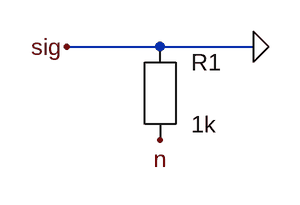
[diagram p0: schematic label_and_ground.asc]
label_and_ground.asc, the LTspice schematic file:
Version 4
SHEET 1 880 680
WIRE 0 96 192 96
SYMBOL res 96 144 R0
SYMATTR InstName R1
SYMATTR Value 1k
FLAG 96 192 n
FLAG 0 96 sig
FLAG 192 96 0

The netlist it stands for:
* label_and_ground.asc
R1 0 n 1k
.backanno
.end